# Altium schematic sheet Sheet2.SchDoc
size C; SheetNumber: 2; SheetTotal: 3
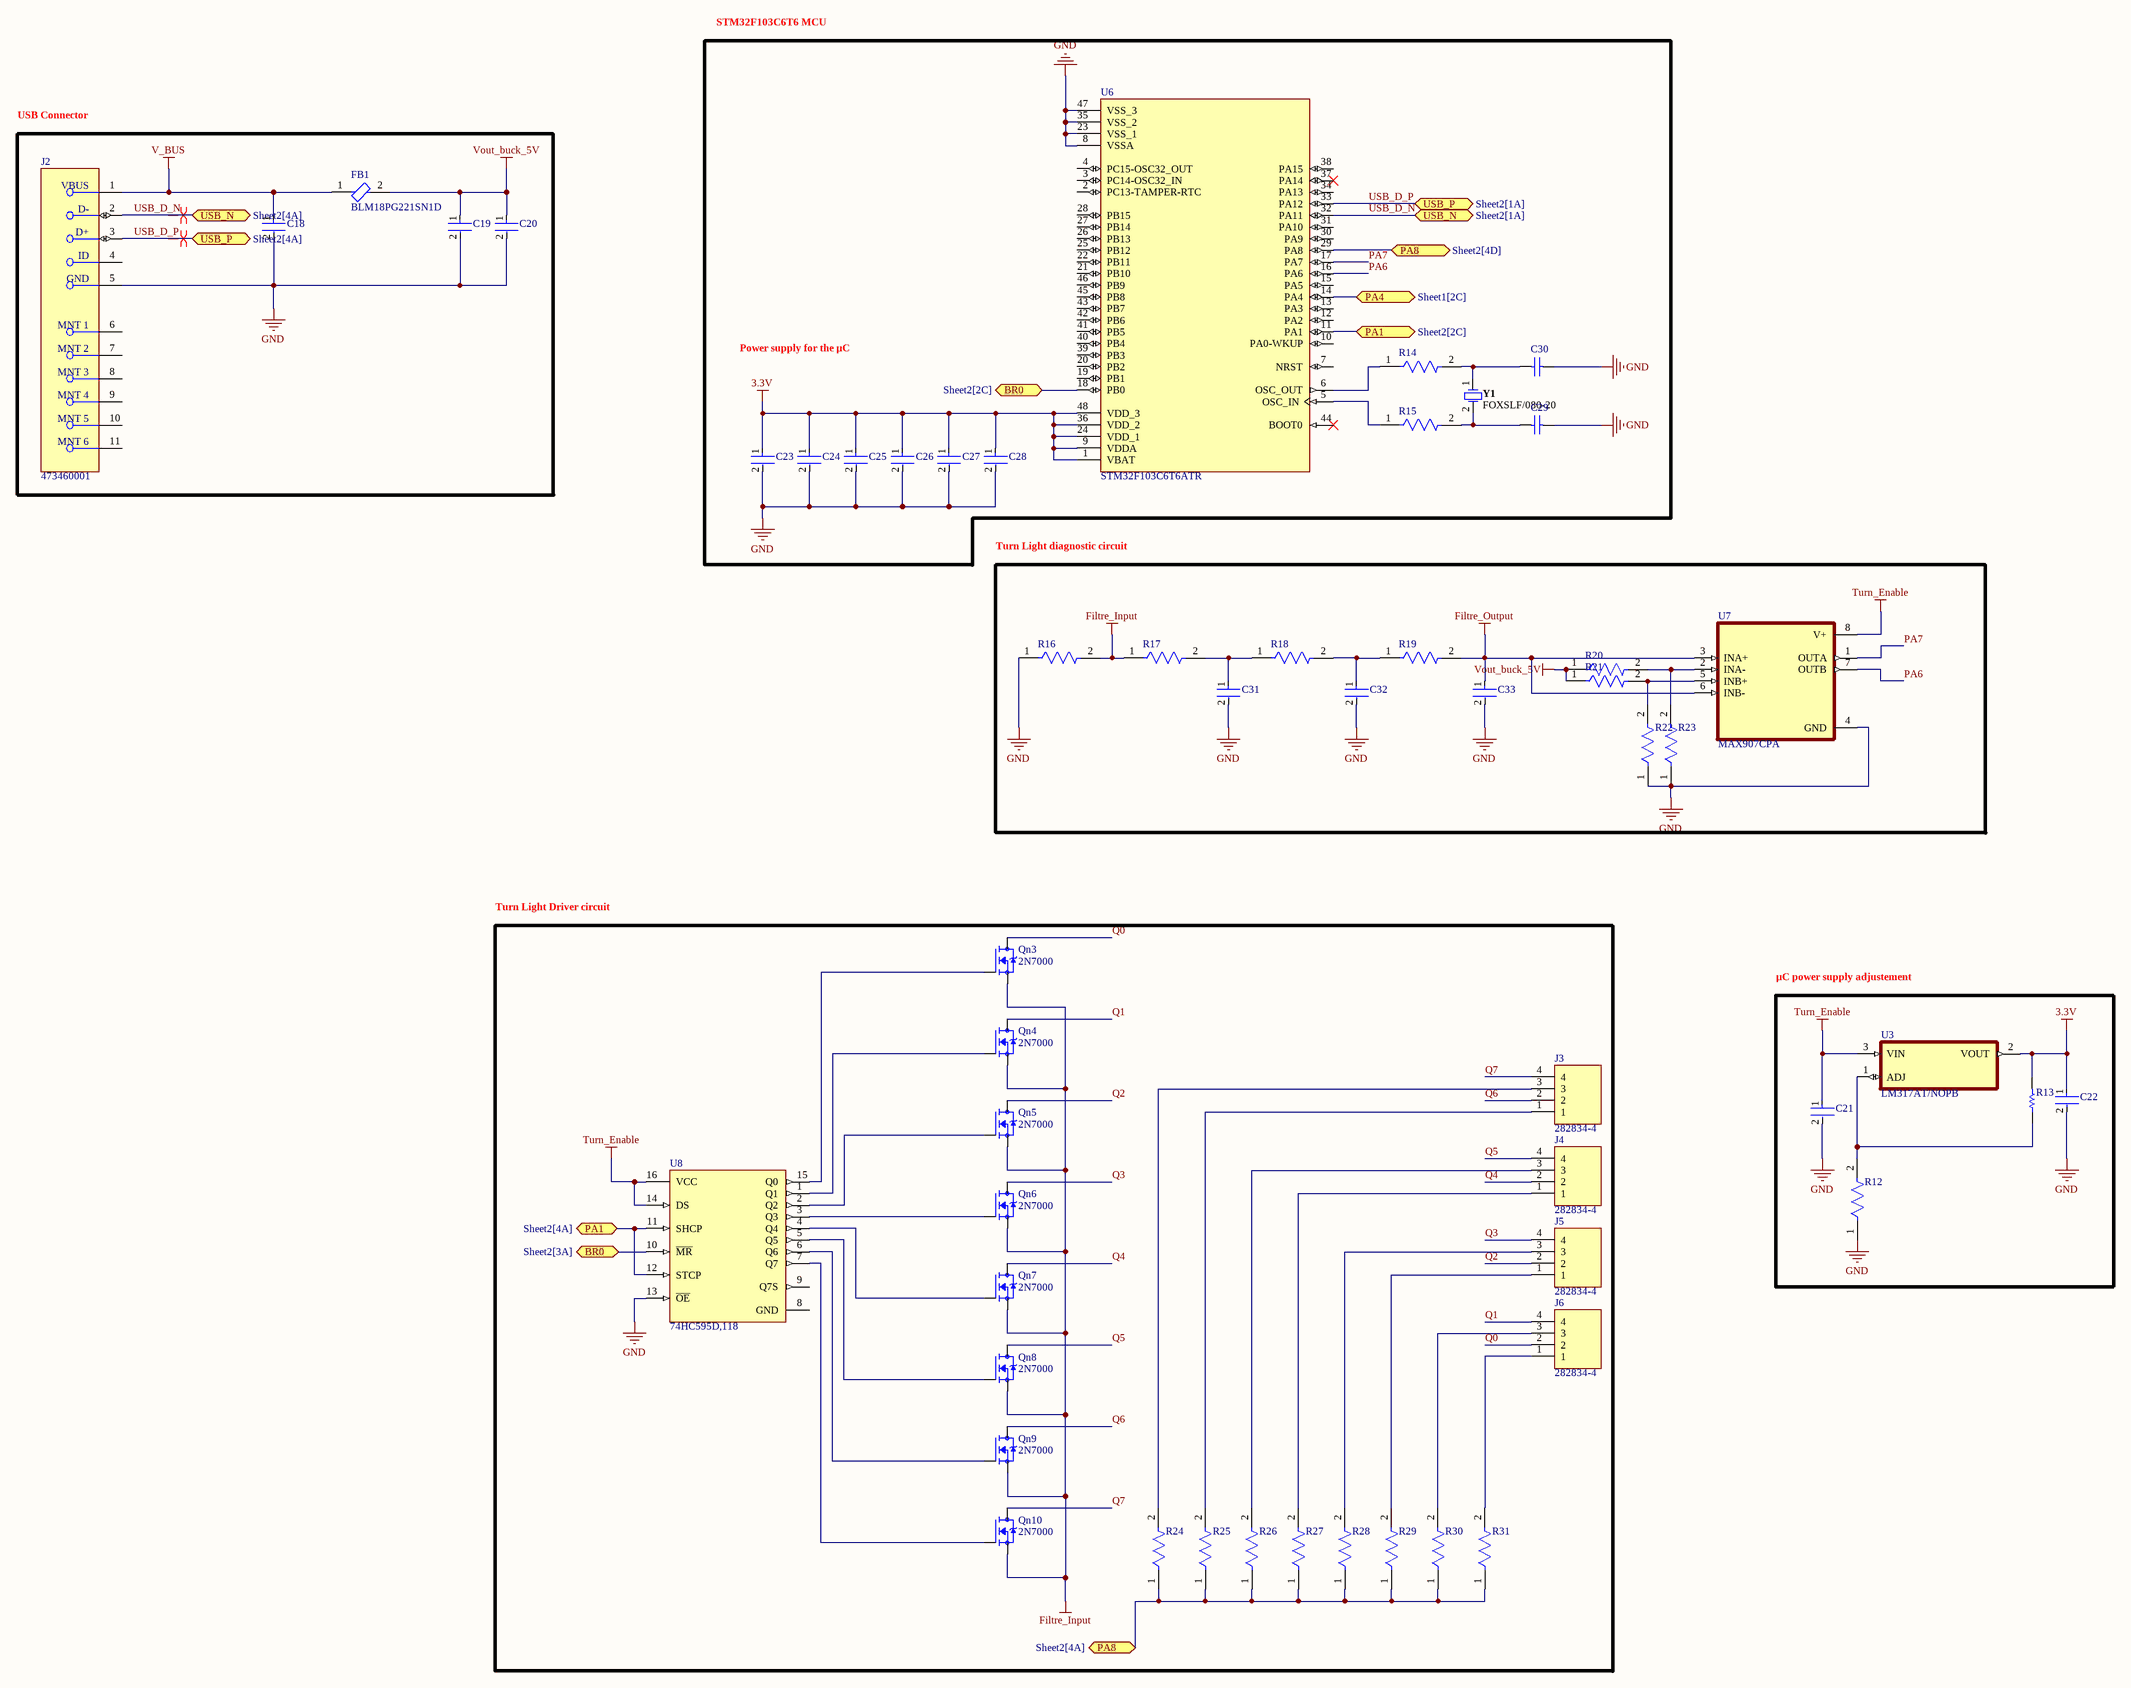
[diagram p0: Sheet2.SchDoc]

## Parts
C18  06035C103KAT2A  [FP-0603-L_1_6_0_15-W_0_81-MFG]  (value not drawn)
C19  C0402C104K8PACTU  [FP-C0402-BB-MFG]  (value not drawn)
C20  GRM155R60J475ME47D  [FP-GRM155-0_1-IPC_B]  (value not drawn)
C21  CGA2B3X7R1H104M050BB  [FP-CGA2B-MFG]  (value not drawn)
C22  C0603C105K3PACTU  [FP-C0603C105K3PACTU-MFG]  (value not drawn)
C23  GRM188R71A225KE15D  [FP-GRM188-0_1-e0_2_0_5-MFG]  (value not drawn)
C24  C0402C104K8PACTU  [FP-C0402-BB-MFG]  (value not drawn)
C25  C0402C104K8PACTU  [FP-C0402-BB-MFG]  (value not drawn)
C26  C0402C104K8PACTU  [FP-C0402-BB-MFG]  (value not drawn)
C27  C0402C104K8PACTU  [FP-C0402-BB-MFG]  (value not drawn)
C28  C0402C104K8PACTU  [FP-C0402-BB-MFG]  (value not drawn)
C29  C1608C0G1H220J080AA  [FP-C1608-080-0_1-IPC_B]  (value not drawn)
C30  08052U220GAT2A  [CAPC2013X115X51NL20T26]  (value not drawn)
C31  GRM188R60J106ME47D  [FP-GRM188-0_1-e0_2_0_55-IPC_A]  (value not drawn)
C32  GRM188R60J106ME47D  [FP-GRM188-0_1-e0_2_0_55-IPC_A]  (value not drawn)
C33  GRM188R60J106ME47D  [FP-GRM188-0_1-e0_2_0_55-IPC_A]  (value not drawn)
FB1  BLM18PG221SN1D  [FP-BLM18-0_15-t0_8-IPC_B]
J2  473460001  [FP-473460001-MFG]
J3  282834-4  [TE_282834-4]
J4  282834-4  [TE_282834-4]
J5  282834-4  [TE_282834-4]
J6  282834-4  [TE_282834-4]
Qn3  2N7000  [TO92-]
Qn4  2N7000  [TO92-]
Qn5  2N7000  [TO92-]
Qn6  2N7000  [TO92-]
Qn7  2N7000  [TO92-]
Qn8  2N7000  [TO92-]
Qn9  2N7000  [TO92-]
Qn10  2N7000  [TO92-]
R12  CRCW0603390RFKEA  [FP-CRCW0603-e3-IPC_B]  (value not drawn)
R13  CRCW0402240RFKED  [RESC1005X40X25ML05T05]  (value not drawn)
R14  RCS06030000Z0EA  [FP-RCS0603-e3-MFG]  (value not drawn)
R15  RCS06030000Z0EA  [FP-RCS0603-e3-MFG]  (value not drawn)
R16  ERJ-2RKF10R0X  [FP-ERJ2RK-MFG]  (value not drawn)
R17  ERA-3AEB102V  [FP-ERA3A-IPC_C]  (value not drawn)
R18  ERA-3AEB102V  [FP-ERA3A-IPC_C]  (value not drawn)
R19  ERA-3AEB102V  [FP-ERA3A-IPC_C]  (value not drawn)
R20  ERA-3AEB102V  [FP-ERA3A-IPC_C]  (value not drawn)
R21  ERA-3AEB102V  [FP-ERA3A-IPC_C]  (value not drawn)
R22  CRCW060350R0FKEA  [FP-CRCW0603-e3-MFG]  (value not drawn)
R23  CRCW0402110RFKED  [FP-CRCW0402-e3-IPC_A]  (value not drawn)
R24  CRCW060350R0FKEA  [FP-CRCW0603-e3-MFG]  (value not drawn)
R25  CRCW060350R0FKEA  [FP-CRCW0603-e3-MFG]  (value not drawn)
R26  CRCW060350R0FKEA  [FP-CRCW0603-e3-MFG]  (value not drawn)
R27  CRCW060350R0FKEA  [FP-CRCW0603-e3-MFG]  (value not drawn)
R28  CRCW060350R0FKEA  [FP-CRCW0603-e3-MFG]  (value not drawn)
R29  CRCW060350R0FKEA  [FP-CRCW0603-e3-MFG]  (value not drawn)
R30  CRCW060350R0FKEA  [FP-CRCW0603-e3-MFG]  (value not drawn)
R31  CRCW060350R0FKEA  [FP-CRCW0603-e3-MFG]  (value not drawn)
U3  LM317AT/NOPB  [TO254P1054X470X1955-3]
U6  STM32F103C6T6ATR  [QFP50P900X900X160-48N]
U7  MAX907CPA  [DIP794W47P254L991H457Q8]
U8  74HC595D,118  [FP-SOT109-1-IPC_C]
Y1  FOXSLF/080-20  [FOX-FOXSLF080-20]

## Blocks framed on the sheet
USB Connector: C18-C20 FB1 J2
Turn Light diagnostic circuit: C31-C33 R16-R23 U7
Turn Light Driver circuit: J3-J6 Qn3-Qn10 R24-R31 U8
µC power supply adjustement: C21 C22 R12 R13 U3

## Ports
BR0 (bidir, see Sheet2[2C]), BR0 (bidir, see Sheet2[3A]), PA1 (bidir, see Sheet2[2C]), PA1 (bidir, see Sheet2[4A]), PA4 (bidir, see Sheet1[2C]), PA8 (bidir, see Sheet2[4A]), PA8 (bidir, see Sheet2[4D]), USB_N (bidir, see Sheet2[1A]), USB_N (bidir, see Sheet2[4A]), USB_P (bidir, see Sheet2[1A]), USB_P (bidir, see Sheet2[4A])

## Nets
3.3V: C22.1 C23.1 C24.1 C25.1 C26.1 C27.1 C28.1 R13.2 U3.2(VOUT) U6.1(VBAT) U6.9(VDDA) U6.24(VDD_1) U6.36(VDD_2) U6.48(VDD_3)
Filtre_Input: Qn3.3(S) Qn4.3(S) Qn5.3(S) Qn6.3(S) Qn7.3(S) Qn8.3(S) Qn9.3(S) Qn10.3(S) R16.2 R17.1
Filtre_Output: C33.1 R19.2 U7.3(INA+) U7.6(INB-)
GND: C18.2 C19.2 C20.2 C21.2 C22.2 C23.2 C24.2 C25.2 C26.2 C27.2 C28.2 C29.1 C30.1 C31.2 C32.2 C33.2 J2.5(GND) R12.1 R16.1 R22.1 R23.1 U6.8(VSSA) U6.23(VSS_1) U6.35(VSS_2) U6.47(VSS_3) U7.4(GND) U8.13(~{OE})
Turn_Enable: C21.1 U3.3(VIN) U7.8(V+) U8.14(DS) U8.16(VCC)
V_BUS: C18.1 FB1.1 J2.1(VBUS)
Vout_buck_5V: C19.1 C20.1 FB1.2 R20.1 R21.1
BR0: U6.18(PB0) U8.10(~{MR}) ; port BR0
PA1: U6.11(PA1) U8.11(SHCP) U8.12(STCP) ; port PA1
PA4: U6.14(PA4) ; port PA4
PA6: U6.16(PA6) U7.7(OUTB)
PA7: U6.17(PA7) U7.1(OUTA)
PA8: R24.1 R25.1 R26.1 R27.1 R28.1 R29.1 R30.1 R31.1 U6.29(PA8) ; port PA8
Q0: J6.2 Qn3.1(D)
Q1: J6.4 Qn4.1(D)
Q2: J5.2 Qn5.1(D)
Q3: J5.4 Qn6.1(D)
Q4: J4.2 Qn7.1(D)
Q5: J4.4 Qn8.1(D)
Q6: J3.2 Qn9.1(D)
Q7: J3.4 Qn10.1(D)
USB_D_N: J2.2(D-) U6.32(PA11) ; port USB_N
USB_D_P: J2.3(D+) U6.33(PA12) ; port USB_P
NetC29_2: C29.2 R15.2 Y1.2
NetC30_2: C30.2 R14.2 Y1.1
NetC31_1: C31.1 R17.2 R18.1
NetC32_1: C32.1 R18.2 R19.1
NetJ3_1: J3.1 R25.2
NetJ3_3: J3.3 R24.2
NetJ4_1: J4.1 R27.2
NetJ4_3: J4.3 R26.2
NetJ5_1: J5.1 R29.2
NetJ5_3: J5.3 R28.2
NetJ6_1: J6.1 R31.2
NetJ6_3: J6.3 R30.2
NetQn3_2: Qn3.2(G) U8.15(Q0)
NetQn4_2: Qn4.2(G) U8.1(Q1)
NetQn5_2: Qn5.2(G) U8.2(Q2)
NetQn6_2: Qn6.2(G) U8.3(Q3)
NetQn7_2: Qn7.2(G) U8.4(Q4)
NetQn8_2: Qn8.2(G) U8.5(Q5)
NetQn9_2: Qn9.2(G) U8.6(Q6)
NetQn10_2: Qn10.2(G) U8.7(Q7)
NetR12_2: R12.2 R13.1 U3.1(ADJ)
NetR14_1: R14.1 U6.6(OSC_OUT)
NetR15_1: R15.1 U6.5(OSC_IN)
NetR20_2: R20.2 R23.2 U7.2(INA-)
NetR21_2: R21.2 R22.2 U7.5(INB+)

Not connected (* = marked no-connect by the designer): J2 4(ID) 6(MNT_1) 7(MNT_2) 8(MNT_3) 9(MNT_4) 10(MNT_5) 11(MNT_6); U6 2(PC13-TAMPER-RTC) 3(PC14-OSC32_IN) 4(PC15-OSC32_OUT) 7(NRST) 10(PA0-WKUP) 12(PA2) 13(PA3) 15(PA5) 19(PB1) 20(PB2) 21(PB10) 22(PB11) 25(PB12) 26(PB13) 27(PB14) 28(PB15) 30(PA9) 31(PA10) 34(PA13) 37(PA14)* 38(PA15) 39(PB3) 40(PB4) 41(PB5) 42(PB6) 43(PB7) 44(BOOT0)* 45(PB8) 46(PB9); U8 8(GND) 9(Q7S)

## Layout directives
differential pair: USB_D_N, USB_D_P

## Notes on the sheet
- STM32F103C6T6 MCU
- Power supply for the µC

## Library data of the parts
C18 = CMP-2006-04374-2: General Purpose Ceramic Capacitor, 0603, 10nF, 10%, X7R, 15%, 50V; Insulation Resistance: 100GR; Dissipation Factor: 2.5%; Voltage: 50V; Number of Pins: 2; Min Operating Temperature: -55°C; Mount: Surface Mount; Capacitance: 10nF; Width: 0.032inch; Height: 0.9mm; Voltage Rating: 50V; Termination: SMD/SMT; Package Quantity: 1; Dielectric: X7R; Max Operating Temperature: 125°C; Contact Plating: Tin; Length: 1.6mm; Dielectric Material: Ceramic; REACH SVHC: No SVHC; Case Code (Imperial): 0603; Depth: 0.81mm; Thickness: 0.035inch; Packaging: Tape and Reel; Tolerance: 10%; Lead Free: Lead Free; Voltage Rating (DC): 50V; Radiation Hardening: No; Case/Package: 0603; Case Code (Metric): 1608
C19 C24-C28 = CMP-2008-02046-2: CAP CER 0.1UF 10V X5R 0402; Manufacturer: Kemet; Material: Ceramic; Capacitance: 0.10 μF; Temperature Coefficient: 15%; Tolerance: 0.1; Value: 0.10 μF; Package: C0402-BB; Temperature: -55°C to +125°C; ComponentLink2Description: Datasheet; Temperature Characteristic: X5R; Device Class L1: Passive Components; Height: 0.55mm; Lead Free: Yes; ComponentLink2URL: https://content.kemet.com/datasheets/KEM_C1002_X7R_SMD.pdf; Device Class L2: Capacitors; Temperature Range Low: -55°C; Temperature Range High: +125°C; RoHS: TRUE; Octopart: https://octopart.com/c0402c104k8pactu-kemet-140039; Automotive: No; Mouser Description: Capacitor 100 nF 10 VDC 0402; Category: Cap; Voltage Rating: 10 V; Digikey Description: CAP CER 0.1UF 10V X5R 0402; Ipc Land Pattern Name: CAPC10050X50; Device Class L3: Ceramic Capacitors; Manufacturer Part Number: C0402C104K8PACTU
C20 = CMP-2008-04549-2: Chip Multilayer Ceramic Capacitors for General Purpose, 0402, 4.7uF, X5R, 15%, 20%, 6.3V; Height: 0.5mm; Weight: 0.000212oz; Length: 1mm; Case Code (Metric): 1005; Packaging: Tape and Reel; Termination: SMD/SMT; Dielectric: X5R; Depth: 0.5mm; Case Code (Imperial): 0402; Min Operating Temperature: -55°C; Case/Package: 0402; Voltage: 6.3V; Width: 0.02inch; Capacitance: 4.7uF; Lead Free: Lead Free; Thickness: 0.022inch; Contact Plating: Tin; REACH SVHC: No SVHC; Package Quantity: 10000; Tolerance: 20%; Voltage Rating (DC): 6.3V; Voltage Rating: 6.3V; Mount: Surface Mount; Max Operating Temperature: 85°C
C21 = CMP-08246-001395-1: Cap Ceramic 100nF 50V X7R 20% Pad SMD 0402 +125°C Automotive T/R; Width: 0.02inch; Capacitance: 100nF; Min Operating Temperature: -55°C; Length: 0.039inch; Tolerance: 20%; Case Code (Metric): 1005; Voltage Rating: 50V; Packaging: Tape and Reel; Ratings: AEC-Q200; Mount: Surface Mount; Thickness: 0.022inch; Package Quantity: 10000; Case Code (Imperial): 0402; Case/Package: 0402; Max Operating Temperature: 125°C
C22 = CMP-2006-02216-3: CAP CER 1UF 25V X5R 0603; Dielectric Material: Ceramic; Tolerance: 10%; Contact Plating: Tin; Number of Pins: 2; Lead Free: Lead Free; Depth: 0.8mm; Length: 1.6mm; Mount: Surface Mount; Case Code (Metric): 1608; Max Operating Temperature: 85°C; Voltage: 25V; Voltage Rating (DC): 25V; REACH SVHC: No SVHC; Height: 0.8mm; Series: C0603C; Case/Package: 0603; Case Code (Imperial): 0603; Capacitance: 1uF; RoHS Compliant: Yes; Dielectric: X5R; Packaging: Tape and Reel; Construction: Flat; Thickness: 0.034inch; Voltage Rating: 25V; Radiation Hardening: No; Width: 0.031inch; Min Operating Temperature: -55°C; Termination: SMD/SMT; Package Quantity: 4000
C23 = CMP-2006-02836-2: Chip Multilayer Ceramic Capacitors for General Purpose, 0603, 2.2uF, X7R, 15%, 10%, 10V; Case Code (Metric): 1608; Height: 0.8mm; Packaging: Cut Tape; Voltage: 10V; Lead Free: Lead Free; Min Operating Temperature: -55°C; Voltage Rating (DC): 10V; Max Operating Temperature: 125°C; Voltage Rating: 10V; Dielectric: X7R; Depth: 0.8mm; Case Code (Imperial): 0603; Termination: SMD/SMT; Case/Package: 0603; Number of Pins: 2; REACH SVHC: No SVHC; Mount: Surface Mount; Width: 0.031inch; Material: Ceramic; Capacitance: 2.2uF; Package Quantity: 1; Weight: 7.1E-05oz; Length: 1.6mm; Thickness: 0.035inch; Tolerance: 10%
C29 C30 = CMP-2008-04304-1: Part Number: GRM1555C1H220JZ01D; Manufacturer: Murata
C31-C33 = CMP-2006-02792-2: Chip Multilayer Ceramic Capacitors for General Purpose, 0603, 10uF, X5R, 15%, 20%, 6.3V; Packaging: Tape and Reel; Voltage Rating (DC): 6.3V; Width: 0.031inch; Termination: SMD/SMT; Dielectric: X5R; Package Quantity: 4000; Voltage Rating: 6.3V; Capacitance: 10uF; Case/Package: 0603; Min Operating Temperature: -55°C; Voltage: 6.3V; Length: 1.6mm; Thickness: 0.035inch; Lead Free: Lead Free; Depth: 0.8mm; Case Code (Imperial): 0603; Max Operating Temperature: 85°C; Material: Ceramic; Height: 0.8mm; Tolerance: 20%; Mount: Surface Mount; REACH SVHC: No SVHC; Radiation Hardening: No; Case Code (Metric): 1608
FB1 = CMP-0686-00569-3: Chip Ferrite Bead, 0603, 220Ω @ 100MHz, 0.1Ω, 25%, 1.4A; Manufacturer Series: BLM18P; Number of Functions: 1; Shielding: Unshielded; ESR (Equivalent Series Resistance): 220R; Material: Steel; DC Resistance-Max: 100mR; Lead Free: Lead Free; Current Rating: 1.4A; Test Frequency: 100MHz; Package Quantity: 1; REACH SVHC: No SVHC; Series: BLM18P; Number of Circuits: 1; Height: 0.8mm; Number of Pins: 2; Termination: SMD/SMT; Width: 0.8mm; Max DC Current: 1.4A; Depth: 0.8mm; RoHS Compliant: Yes; Case Code (Imperial): 0603; Number of Lines: 1; Length: 1.6mm; Max Current Rating: 1.4A; Case/Package: 0603; DC Current: 1.4A; Max Operating Temperature: 125°C; Weight: 7.1E-05oz; Tolerance: 25%; Impedance: 220R; Radiation Hardening: No; Packaging: Tape and Reel; DC Resistance (DCR): 100mR; Resistance: 100mR; Min Operating Temperature: -55°C; Core Material: Ferrite; Case Code (Metric): 1608
J2 = CMP-2000-05246-2: CONN RCPT USB2.0 MICRO B SMD R/A; Manufacturer: Molex; Conn Orientation: Right Angle; Is Female: yes; Shielding: true; Pitch: 0.65mm; Number Of Contacts: 5; Voltage Rating: 30V; Current Rating: 1.8A; Device Class L2: USB Connectors; Digikey Description: CONN RCPT USB2.0 MICRO B SMD R/A; Height: 2.945mm; RoHS: TRUE; ComponentLink2Description: Datasheet; Octopart: https://octopart.com/47346-0001-molex-7164928; Automotive: No; Package: 0; Category: Conn; Device Class L1: Connectors; Usb Standard: USB 2.0; Temperature: -30°C to +85°C; Temperature Range Low: -30°C; Footprint Url: https://www.molex.com/pdm_docs/sd/473460001_sd.pdf; ComponentLink2URL: https://www.molex.com/webdocs/datasheets/pdf/en-us/0473460001_IO_CONNECTORS.pdf; Lead Free: Yes; Manufacturer Part Number: 473460001; Contact Material: Gold,Nickel; Temperature Range High: +85°C; Device Class L3: unset
J3-J6 = 282834-4: 4 Position Wire to Board Terminal Block Horizontal with Board 0.100 (2.54mm) Through Hole; MF: TE Connectivity; Check_prices: https://www.snapeda.com/parts/282834-4/TE+Connectivity+AMP+Connectors/view-part/?ref=eda; Price: None; MP: 282834-4; Package: None; Value: *; Purchase-URL: https://pricing.snapeda.com/search/part/282834-4/?ref=eda; Availability: In Stock; EU_RoHS_Compliance: Compliant with Exemptions; SnapEDA_Link: https://www.snapeda.com/parts/282834-4/TE+Connectivity+AMP+Connectors/view-part/?ref=snap
Qn3-Qn10 = 2N7000: N-Channel 60 V 350mA (Tc) 1W (Tc) Through Hole TO-92-3; MF: STMicroelectronics; Package: E-PKG AXIAL-LEADED-2 ON Semiconductor; Price: None; Check_prices: https://www.snapeda.com/parts/2N7000/STMicroelectronics/view-part/?ref=eda; Value: *; SnapEDA_Link: https://www.snapeda.com/parts/2N7000/STMicroelectronics/view-part/?ref=snap; MP: 2N7000; Availability: In Stock; Purchase-URL: https://pricing.snapeda.com/search?q=2N7000&ref=eda
R12 = CMP-2000-03284-2: RES Thick Film, 390Ω, 1%, 0.1W, 100ppm/°C, 0603; Voltage Rating: 75V; Power Rating: 100mW; Resistance: 390R; Working Voltage: 75V; Length: 1.55mm; Case/Package: 0603; Width: 0.033inch; Features: Automotive AEC-Q200; Mount: Surface Mount; Package Quantity: 10; Termination: SMD/SMT; Contact Plating: Tin; Lead Free: Lead Free; Min Operating Temperature: -55°C; Max Operating Temperature: 155°C; Temperature Coefficient: 100ppm/°C; Packaging: Tape and Reel; Case Code (Imperial): 0603; Military Standard: Not; Max Power Dissipation: 100mW; Weight: 7.1E-05oz; Height: 0.45mm; Tolerance: 1%; Voltage Rating (DC): 75V; Depth: 0.85mm; Number of Terminations: 2; Case Code (Metric): 1608; Composition: Thick Film; Radiation Hardening: No
R13 = CMP-2002-08397-1: Manufacturer: Vishay Dale; Part Number: CRCW0402240RFKED
R14 R15 = CMP-02407-013117-1: RES SMD 0 OHM JUMPER 1/4W 0603; Max Power Dissipation: 250mW; Resistance: 0R; Case Code (Metric): 1608; Packaging: Cut Tape; RoHS Compliant: Yes; Ratings: AEC-Q200; Max Operating Temperature: 155°C; Resistor Type: Thick Film; Features: Automotive AEC-Q200; Case Code (Imperial): 0603; Number of Terminations: 2; Min Operating Temperature: -55°C; Width: 0.033inch; Height: 0.02inch; Series: RCS e3; Length: 0.061inch; Case/Package: 0603
R16 = CMP-2002-00622-4: RES SMD 10 OHM 1% 1/10W 0402; Manufacturer: Panasonic; Power Rating: 0.1W; Value: 10Ω; Automotive Grade: Grade 0; Temperature Coefficient: 100ppm/°C; Voltage Rating: 50V; Octopart: https://octopart.com/erj-2rkf10r0x-panasonic-55404982; Digikey Description: RES SMD 10 OHM 1% 1/10W 0402; Mouser Description: Thick Film Resistors - SMD 0402 10.0ohms 1% Tol AEC-Q200; Series: ERJ; Temperature Range High: +155°C; ComponentLink2Description: Datasheet; Tolerance: 1%; Manufacturer Part Number: ERJ-2RKF10R0X; Temperature Range Low: -55°C; RoHS: TRUE; Footprint Url: https://industrial.panasonic.com/cdbs/www-data/pdf/RDA0000/DMA0000COL17.pdf; Lead Free: Yes; Device Class L2: Resistors; ComponentLink2URL: https://industrial.panasonic.com/cdbs/www-data/pdf/RDA0000/AOA0000C304.pdf; Height: 0.4mm; Device Class L3: Chip SMD Resistors; Device Class L1: Passive Components; Automotive: Yes; Resistance: 10Ω; Category: Res; Temperature: -55°C to +155°C; Composition: Thick Film; Package: ERJ2RK
R17-R21 = CMP-2000-00873-2: RES SMD 1K OHM 0.1% 1/10W 0603; Temperature Coefficient: 25ppm/°C; Voltage Rating: 75V; Max Power Dissipation: 100mW; Resistance: 1kR; Technology: METAL FILM; Number of Pins: 2; Packaging: Tape and Reel; Case Code (Imperial): 0603; Case Code (Metric): 1608; Min Operating Temperature: -55°C; REACH SVHC: No SVHC; Length: 1.6mm; Termination: SMD/SMT; Depth: 0.8mm; Resistance Tolerance: 0.1%; Number of Terminations: 2; Width: 0.8mm; Military Standard: Not; Tolerance: 0.1%; Package Quantity: 5000; Contact Plating: Tin; Height: 0.45mm; Construction: Rectangular; Case/Package: 0603; Max Operating Temperature: 155°C; Resistor Type: Thin Film; Series: ERA-3A; Size Code: 0603; RoHS Compliant: Yes; Mount: Surface Mount; Radiation Hardening: No; Power Rating: 100mW
R22 R24-R31 = CMP-2000-03436-2: RES Thick Film, 50Ω, 1%, 0.1W, 100ppm/°C, 0603; Voltage Rating (DC): 75V; Resistance: 50R; Power Rating: 100mW; Case/Package: 0603; Packaging: Tape and Reel; Military Standard: Not; REACH SVHC: No SVHC; Width: 0.85mm; Max Operating Temperature: 155°C; Case Code (Metric): 1608; Temperature Coefficient: 100ppm/°C; Lead Free: Lead Free; Height: 0.45mm; Composition: Thick Film; Termination: SMD/SMT; Contact Plating: Tin; Number of Pins: 2; Tolerance: 1%; Depth: 0.85mm; Weight: 7.1E-05oz; Min Operating Temperature: -55°C; Length: 1.55mm; Radiation Hardening: No; Voltage Rating: 75V; Case Code (Imperial): 0603; Package Quantity: 5000; Mount: Surface Mount
R23 = CMP-2002-08150-2: RES Thick Film, 110Ω, 1%, 0.063W, 100ppm/°C, 0402; Voltage Rating (DC): 50V; Max Power Dissipation: 63mW; Resistance: 110R; Radiation Hardening: No; Resistor Type: Thick Film; Termination: SMD/SMT; Tolerance: 1%; Number of Pins: 2; Package Quantity: 10000; Length: 1mm; RoHS Compliant: Yes; Lead Free: Lead Free; Case Code (Imperial): 0402; Number of Terminations: 2; Technology: THICK FILM; Width: 0.5mm; Case/Package: 0402; Depth: 0.5mm; Max Operating Temperature: 155°C; Features: Automotive AEC-Q200; Size Code: 0402; Temperature Coefficient: 100ppm/°C; Weight: 2.3E-05oz; Contact Plating: Tin; Min Operating Temperature: -55°C; Height: 0.35mm; Power Rating: 63mW; Packaging: Tape and Reel; Case Code (Metric): 1005; Resistance Tolerance: 1%; Military Standard: Not; Voltage Rating: 50V; Series: CRCW; Construction: Rectangular
U3 = LM317AT/NOPB: 1.5-A, 40-V, adjustable linear voltage regulator with high-accuracy 3-TO-220 -40 to 125; MF: Texas Instruments; Check_prices: https://www.snapeda.com/parts/LM317AT/Texas+Instruments/view-part/?ref=eda; Value: *; Availability: In Stock; MP: LM317AT; Price: None; Package: TO-220-3 Texas Instruments; SnapEDA_Link: https://www.snapeda.com/parts/LM317AT/Texas+Instruments/view-part/?ref=snap; Purchase-URL: https://pricing.snapeda.com/search/part/LM317AT/?ref=eda
U6 = STM32F103C6T6ATR: ARMÂ® CortexÂ®-M3 STM32F1 Microcontroller IC 32-Bit 72MHz 32KB (32K x 8) FLASH; MF: STMicroelectronics; Availability: In Stock; Purchase-URL: https://pricing.snapeda.com/search/part/STM32F103C6T6ATR/?ref=eda; SnapEDA_Link: https://www.snapeda.com/parts/STM32F103C6T6ATR/STMicroelectronics/view-part/?ref=snap; MP: STM32F103C6T6ATR; Price: None; Value: *; Check_prices: https://www.snapeda.com/parts/STM32F103C6T6ATR/STMicroelectronics/view-part/?ref=eda; Package: LQFP-48 STMicroelectronics
U7 = MAX907CPA: Comparator General Purpose TTL 8-PDIP; MF: Maxim Integrated; Package: DIP-8 Maxim Integrated; Check_prices: https://www.snapeda.com/parts/MAX907CPA/Maxim+Integrated/view-part/?ref=eda; Value: *; Price: None; Purchase-URL: https://pricing.snapeda.com/search/part/MAX907CPA/?ref=eda; MP: MAX907CPA; SnapEDA_Link: https://www.snapeda.com/parts/MAX907CPA/Maxim+Integrated/view-part/?ref=snap; Availability: In Stock
U8 = CMP-14351-000006-1: IC SHIFT REGISTER 8BIT 16SOIC; RoHS Compliant: Yes
Y1 = CMP-1749-00002-1: Resistance Weld Thru-Hole Crystal, 8 MHz, -20 to 70 degC, 2-Pin THD, RoHS, Bulk; Dropout Voltage: 2 V; Outputs: 1; Nominal Output Voltage: 5 V; Min Input Voltage: 7 V; Case\Package: TO-263-3; Max Input Voltage: 35 V; Max Ouput Current: 1 A; Length: 10.24 mm; Max Operating Temperature: 125 degC; Mount: Surface Mount; PackageDescription: 2-Pin Through Hole Device, Body 11.35 x 4.65 mm; Package Quantity: 50; Pins: 3; ComponentLink2URL: http://download.siliconexpert.com/pdfs/2015/4/5/6/5/7/200/fox_/manual/35607121449963728hc49slf.pdf; PackageReference: FOXSLF080-20; Min Operating Temperature: 0 degC; Height: 30.02 mm; Packaging: Rail/Tube; Radiation Hardening: No; Width: 9.35 mm; ComponentLink1URL: http://www.foxonline.com/; DatasheetVersion: Mar-15; ComponentLink1Description: Manufacturer URL; Output Voltage: 5 V; RoHSCompliant: true; REACH SVHC: No SVHC; Output Current: 1 A; ComponentLink2Description: Datasheet